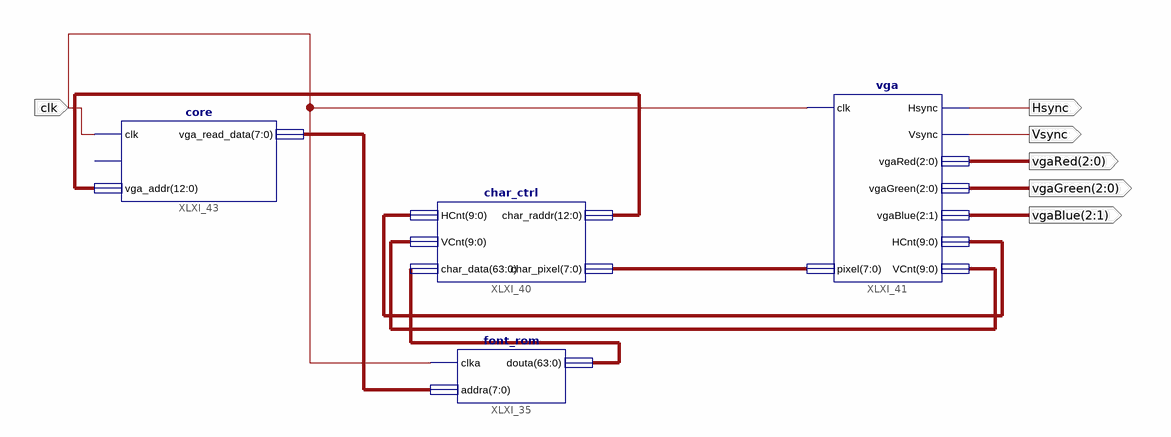
[diagram p0: schematic sheet 1]
// Xilinx ISE schematic mmix.sch (spartan3e) as structural Verilog: 4 symbols, 6 ports
module mmix (
  input  clk,
  output [2:1] vgaBlue,
  output [2:0] vgaGreen,
  output [2:0] vgaRed,
  output Hsync,
  output Vsync
);

  wire [7:0] char_pixel, vga_read_data;
  wire [9:0] XLXN_138, XLXN_139;
  wire [12:0] vga_addr;
  wire [63:0] char_data;

  font_rom XLXI_35 (.clka(clk), .addra(vga_read_data), .douta(char_data));
  char_ctrl XLXI_40 (
    .HCnt(XLXN_138), .VCnt(XLXN_139), .char_data(char_data), .char_raddr(vga_addr), .char_pixel(char_pixel));
  vga XLXI_41 (
    .clk(clk), .pixel(char_pixel), .Hsync(Hsync), .Vsync(Vsync), .vgaRed(vgaRed), .vgaGreen(vgaGreen),
    .vgaBlue(vgaBlue), .HCnt(XLXN_138), .VCnt(XLXN_139));
  core XLXI_43 (.clk(clk), .vga_addr(vga_addr), .vga_read_data(vga_read_data));  // open: reset
endmodule
